# EAGLE schematic ignition_board_sch (EAGLE 8.6.0)
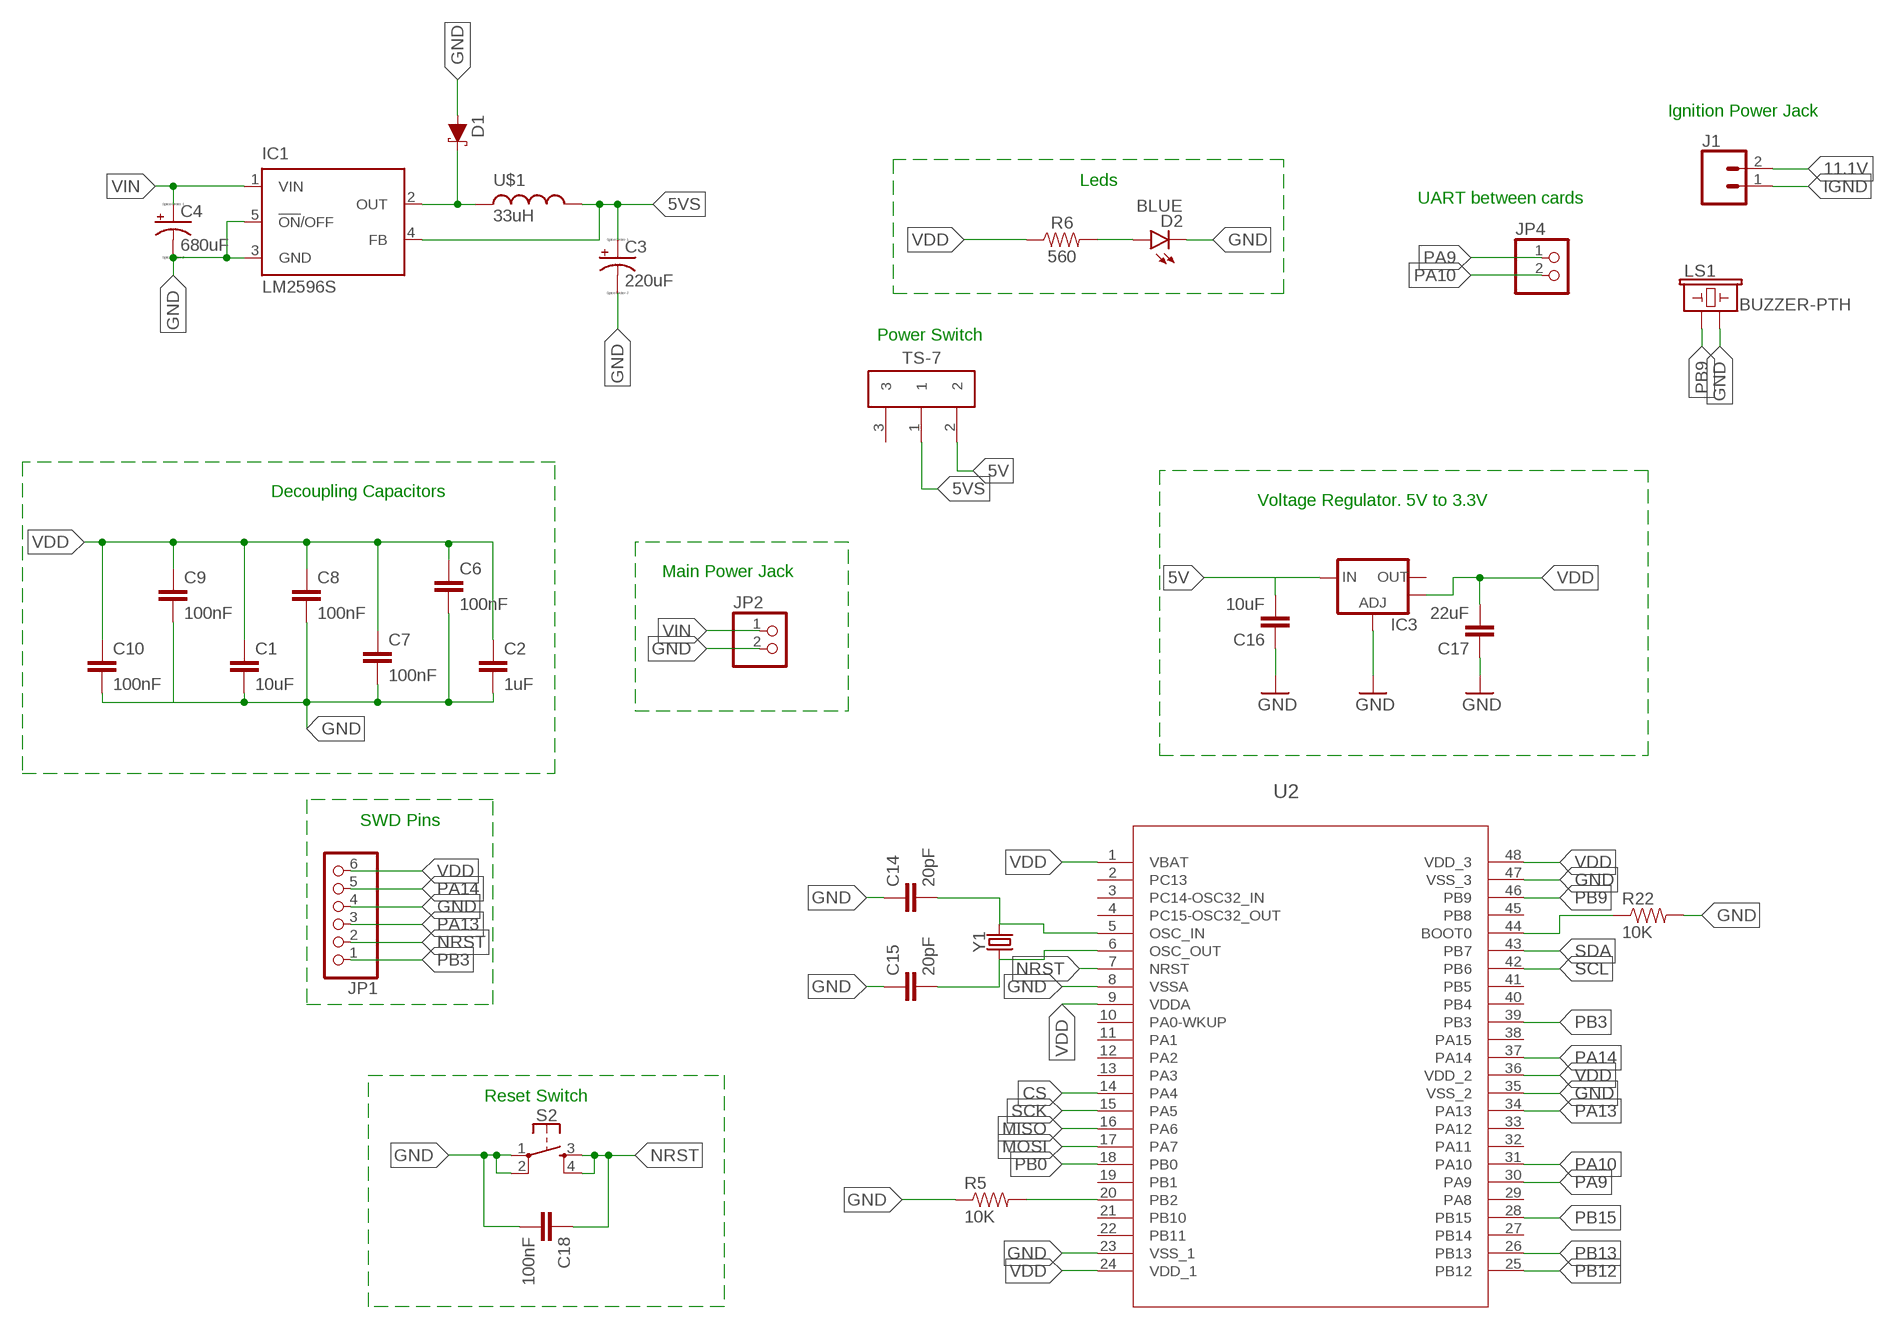
[diagram p0: schematic, sheet 1, part 1 of 2]
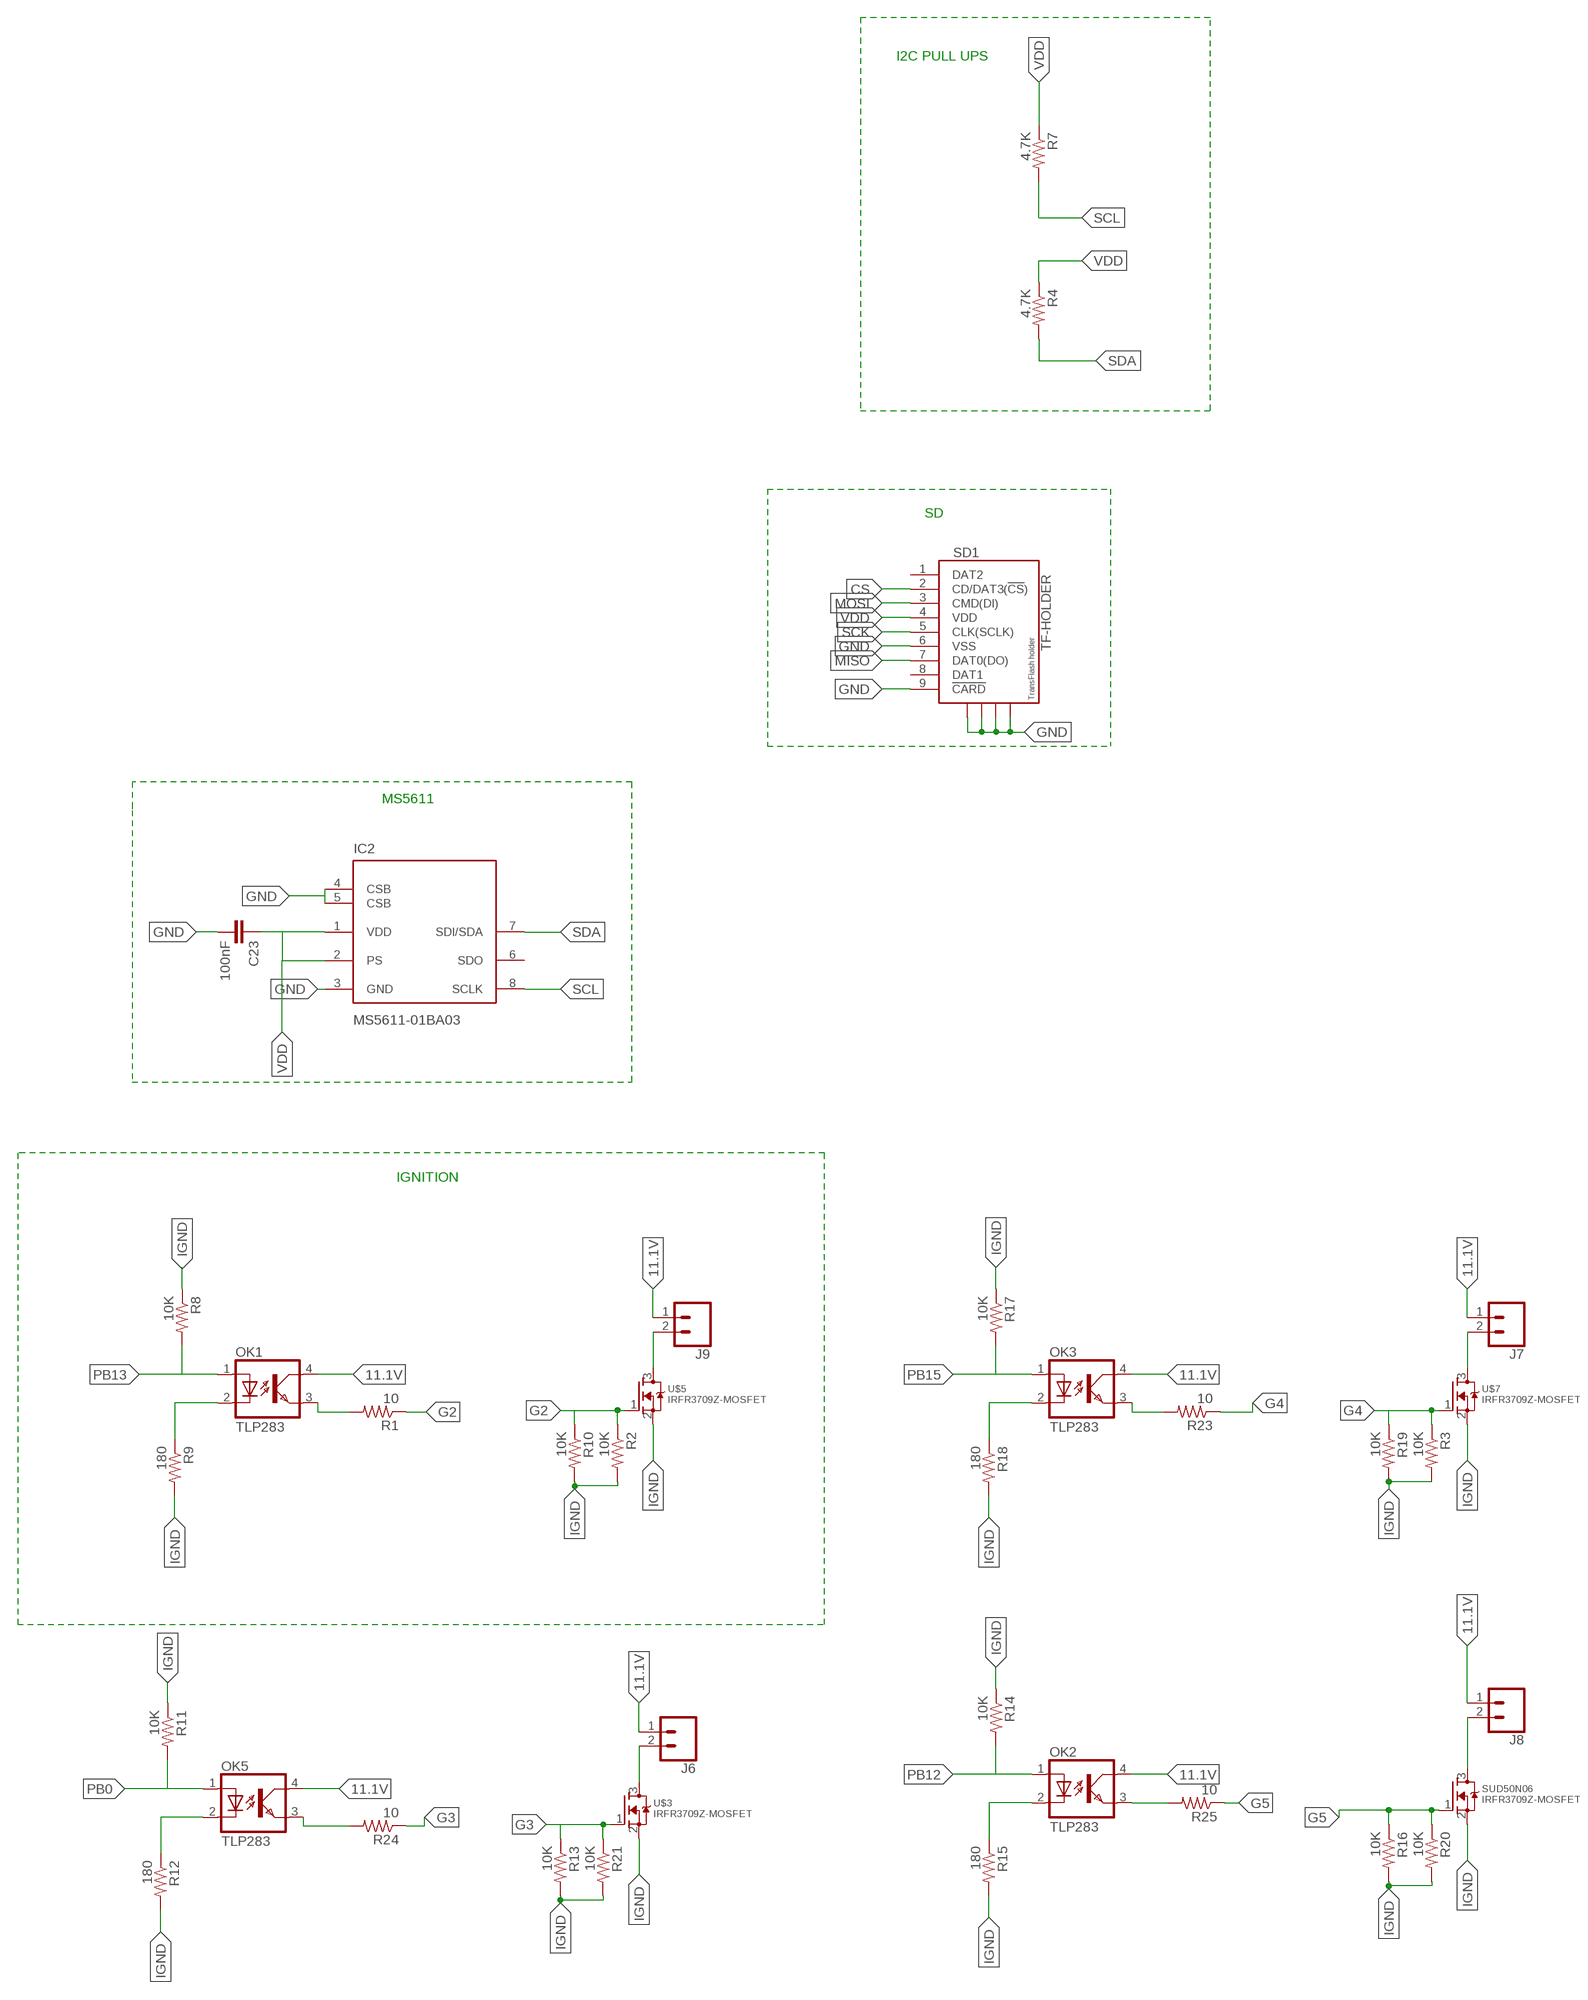
[diagram p1: schematic, sheet 1, part 2 of 2]

## Parts
C1  10uF  10UF-0805-10V-10%  [0805]
C2  1uF  10UF-0805-10V-10%  [0805]
C3  220uF  CPOL-USTT5D7  [TT5D7]
C4  680uF  CPOL-USTT5D7  [TT5D7]
C6  100nF  10UF-0805-10V-10%  [0805]
C7  100nF  10UF-0805-10V-10%  [0805]
C8  100nF  10UF-0805-10V-10%  [0805]
C9  100nF  10UF-0805-10V-10%  [0805]
C10  100nF  10UF-0805-10V-10%  [0805]
C14  20pF  10UF-0805-10V-10%  [0805]
C15  20pF  10UF-0805-10V-10%  [0805]
C16  10uF  CAP0805  [0805@2]
C17  22uF  CAP0805  [0805@2]
C18  100nF  10UF-0805-10V-10%  [0805]
C23  100nF  CAP0805  [0805@2]
D1  3A/40V/500mV  DIODE-SCHOTTKY-B340A  [SMA-DIODE]
D2  BLUE  LED-BLUE1206  [LED-1206]
IC1  LM2596S  [TO263-5]
IC2  MS5611-01BA03  [SON125P300X500X100-8N]
IC3  V_REG_LM1117SOT223  [SOT223]
J1  CONN_025MM  [SCREWTERMINAL-5MM-2]
J6  CONN_025MM  [SCREWTERMINAL-5MM-2]
J7  CONN_025MM  [SCREWTERMINAL-5MM-2]
J8  CONN_025MM  [SCREWTERMINAL-5MM-2]
J9  CONN_025MM  [SCREWTERMINAL-5MM-2]
JP1  PINHD-1X6  [1X06]
JP2  PINHD-1X2  [1X02]
JP4  PINHD-1X2/90  [1X02/90]
LS1  BUZZER-PTH  [BUZZER-12MM]
OK1  TLP283  [MINI-FLAT-4]
OK2  TLP283  [MINI-FLAT-4]
OK3  TLP283  [MINI-FLAT-4]
OK5  TLP283  [MINI-FLAT-4]
R1  10  RESISTOR0805-RES  [0805]
R2  10K  RESISTOR0805-RES  [0805]
R3  10K  RESISTOR0805-RES  [0805]
R4  4.7K  RESISTOR0805-RES  [0805]
R5  10K  RESISTOR0805-RES  [0805]
R6  560  0.3OHM-0805-1/8W-1%  [0805@1]
R7  4.7K  RESISTOR0805-RES  [0805]
R8  10K  RESISTOR0805-RES  [0805]
R9  180  RESISTOR0805-RES  [0805]
R10  10K  RESISTOR0805-RES  [0805]
R11  10K  RESISTOR0805-RES  [0805]
R12  180  RESISTOR0805-RES  [0805]
R13  10K  RESISTOR0805-RES  [0805]
R14  10K  RESISTOR0805-RES  [0805]
R15  180  RESISTOR0805-RES  [0805]
R16  10K  RESISTOR0805-RES  [0805]
R17  10K  RESISTOR0805-RES  [0805]
R18  180  RESISTOR0805-RES  [0805]
R19  10K  RESISTOR0805-RES  [0805]
R20  10K  RESISTOR0805-RES  [0805]
R21  10K  RESISTOR0805-RES  [0805]
R22  10K  RESISTOR0805-RES  [0805]
R23  10  RESISTOR0805-RES  [0805]
R24  10  RESISTOR0805-RES  [0805]
R25  10  RESISTOR0805-RES  [0805]
S2  MOMENTARY-SWITCH-SPST-2-SMD-5.2MM  [TACTILE_SWITCH_SMD_5.2MM]
SD1  TF-HOLDER  [TF-PULL]
SUD50N06  IRFR3709Z-MOSFET  [TO252]
TS-7  TS-7  [TS7]
U2  STM32F103CXT2  [LQFP48-7X7MM]
U$1  33uH  MSS1260  [MSS1260]
U$3  IRFR3709Z-MOSFET  [TO252]
U$5  IRFR3709Z-MOSFET  [TO252]
U$7  IRFR3709Z-MOSFET  [TO252]
Y1  CRYSTALPTH-HC49US  [HC49US]

## Nets
5V: C16.2 IC3.3(IN) TS-7.2
5VS: C3.+ IC1.4(FB) TS-7.1 U$1.P$1
11.1V: J1.2 J6.1 J7.1 J8.1 J9.1 OK1.4(COL) OK2.4(COL) OK3.4(COL) OK5.4(COL)
CS: SD1.2(CD/DAT3(!CS!)) U2.14(PA4)
G2: R1.1 R2.1 R10.1 U$5.1(G)
G3: R13.1 R21.1 R24.1 U$3.1(G)
G4: R3.1 R19.1 R23.1 U$7.1(G)
G5: R16.1 R20.1 R25.1 SUD50N06.1(G)
GND: C1.2 C2.2 C3.- C4.- C6.2 C7.2 C8.2 C9.2 C10.2 C14.1 C15.1 C16.1 C17.1 C18.2 C23.2 D1.A D2.C IC1.3(GND) IC1.5(!ON!/OFF) IC2.3(GND) IC2.4(CSB) IC2.5(CSB) IC3.1(ADJ) JP1.4 JP2.2 LS1.- R5.1 R22.2 S2.1 S2.2 SD1.6(VSS) SD1.9(!CARD) SD1.S1 SD1.S2 SD1.S3 SD1.S4 U2.8(VSSA) U2.23(VSS_1) U2.35(VSS_2) U2.47(VSS_3)
IGND: J1.1 R2.2 R3.2 R8.1 R9.2 R10.2 R11.1 R12.2 R13.2 R14.1 R15.2 R16.2 R17.1 R18.2 R19.2 R20.2 R21.2 SUD50N06.2(S) U$3.2(S) U$5.2(S) U$7.2(S)
MISO: SD1.7(DAT0(DO)) U2.16(PA6)
MOSI: SD1.3(CMD(DI)) U2.17(PA7)
N$2: C15.2 U2.6(OSC_OUT) Y1.1
N$3: C14.2 U2.5(OSC_IN) Y1.2
N$8: R22.1 U2.44(BOOT0)
N$11: D1.C IC1.2(OUT) U$1.P$2
N$12: OK1.3(EMIT) R1.2
N$13: R5.2 U2.20(PB2)
N$14: D2.A R6.2
N$15: OK2.3(EMIT) R25.2
N$17: J7.2 U$7.3(D)
N$18: J9.2 U$5.3(D)
N$19: J6.2 U$3.3(D)
N$21: OK3.3(EMIT) R23.2
N$22: OK5.2(C) R12.1
N$23: OK5.3(EMIT) R24.2
N$24: J8.2 SUD50N06.3(D)
N$25: OK2.2(C) R15.1
N$27: OK1.2(C) R9.1
N$31: OK3.2(C) R18.1
NRST: C18.1 JP1.2 S2.3 S2.4 U2.7(NRST)
PA9: JP4.1 U2.30(PA9)
PA10: JP4.2 U2.31(PA10)
PA13: JP1.3 U2.34(PA13)
PA14: JP1.5 U2.37(PA14)
PB0: OK5.1(A) R11.2 U2.18(PB0)
PB3: JP1.1 U2.39(PB3)
PB9: LS1.+ U2.46(PB9)
PB12: OK2.1(A) R14.2 U2.25(PB12)
PB13: OK1.1(A) R8.2 U2.26(PB13)
PB15: OK3.1(A) R17.2 U2.28(PB15)
SCK: SD1.5(CLK(SCLK)) U2.15(PA5)
SCL: IC2.8(SCLK) R7.2 U2.42(PB6)
SDA: IC2.7(SDI/SDA) R4.2 U2.43(PB7)
VDD: C1.1 C2.1 C6.1 C7.1 C8.1 C9.1 C10.1 C17.2 C23.1 IC2.1(VDD) IC2.2(PS) IC3.4(OUT) JP1.6 R4.1 R6.1 R7.1 SD1.4(VDD) U2.1(VBAT) U2.9(VDDA) U2.24(VDD_1) U2.36(VDD_2) U2.48(VDD_3)
VIN: C4.+ IC1.1(VIN) JP2.1
Unconnected: IC2.6(SDO) IC3.2(OUT) SD1.1(DAT2) SD1.8(DAT1) TS-7.3 U2.2(PC13) U2.3(PC14-OSC32_IN) U2.4(PC15-OSC32_OUT) U2.10(PA0-WKUP) U2.11(PA1) U2.12(PA2) U2.13(PA3) U2.19(PB1) U2.21(PB10) U2.22(PB11) U2.27(PB14) U2.29(PA8) U2.32(PA11) U2.33(PA12) U2.38(PA15) U2.40(PB4) U2.41(PB5) U2.45(PB8)

## Notes on the sheet
- I2C PULL UPS
- Ignition Power Jack
- Leds
- UART between cards
- Power Switch
- Decoupling Capacitors
- Voltage Regulator. 5V to 3.3V
- SD
- Main Power Jack
- SWD Pins
- MS5611
- Reset Switch
- IGNITION

## Library data of the parts
C1 = SparkFun-Capacitors:10UF: 10.0µF ceramic capacitors A capacitor is a passive two-terminal electrical component used to store electrical energy temporarily in an electric field.; PROD_ID: CAP-11330
C2 C6-C10 C14 C15 C18 = SparkFun-Capacitors:10UF: 10.0µF ceramic capacitors A capacitor is a passive two-terminal electrical component used to store electrical energy temporarily in an electric field.; PROD_ID: CAP-11330; VALUE: 10uF
C3 C4 = resistor:CPOL-US: POLARIZED CAPACITOR, American symbol
C16 C17 C23 = SparkFun-Capacitors:CAP: Capacitor Standard 0603 ceramic capacitor, and 0.1" leaded capacitor.
D1 = SparkFun-DiscreteSemi:DIODE-SCHOTTKY: Schottky diode A Schottky diode is a semiconductor diode which has a low forward voltage drop and a very fast switching action.; PROD_ID: DIO-09886
D2 = SparkFun-LED:LED-BLUE: Blue LEDs for production use Various blue LEDs stocked by SparkFun production 0603 - DIO-08575 Rebel - DIO-09553 1206 - DIO-09911; PROD_ID: DIO-09911
IC1 = national-semiconductor:LM2596: SIMPLE SWITCHER® Power Converter 150 kHz 3A Step-Down Voltage Regulator Source: http://www.national.com/ds/LM/LM2596.pdf; MF: NATIONAL SEMICONDUCTOR; MPN: LM2596S-ADJ/NOPB; OC_FARNELL: 9494367; OC_NEWARK: 41K3842
IC2 = Measurement-Specialties:MS5611-01BA03: Variometer Module, with stainless steel cap
IC3 = SparkFun:V_REG_LM1117: Voltage Regulator LM1117 Standard adjustable voltage regulator but in SMD form. Spark Fun Electronics SKU : COM-00595
J1 J6-J9 = SparkFun-Connectors:CONN_02: Multi connection point. Often used as Generic Header-pin footprint for 0.1 inch spaced/style header connections On any of the 0.1 inch spaced packages, you can populate with these: Break Away Headers - Straight <https://www.sparkfun.com/products/116> (PRT-00116) Break Away Male Headers - Right Angle <https://www.sparkfun.com/products/553> (PRT-00553) Female Headers <https://www.sparkfun.com/products/115> (PRT-00115) Break Away Headers - Machine Pin <https://www.sparkfun.com/products/117> (PRT-00117) Break Away Female Headers - Swiss Machine Pin <https://www.sparkfun.com/products/743> (PRT-00743) For SCREWTERMINALS and SPRING TERMINALS visit here: Screw Terimnals on SparkFun.com <https://www.sparkfun.com/search/results?term=Screw+Terminals> (5mm/3.5mm/2.54mm spacing) This device is also useful as a general connection point to wire up your design to another part of your project. Our various solder wires solder well into these plated through hole pads. Hook-Up Wire - Assortment (Stranded, 22 AWG) <https://www.sparkfun.com/products/11375> (PRT-11375) Hook-Up Wire - Assortment (Solid Core, 22 AWG) <https://www.sparkfun.com/products/11367> (PRT-11367) View the entire wire category on our website here <https://www.sparkfun.com/categories/141> Special notes: Molex polarized connector foot print use with: PRT-08233 with associated crimp pins and housings. 2.54_SCREWTERM for use with PRT-10571. 3.5mm Screw Terminal footprints for PRT-08084 5mm Screw Terminal footprints for use with PRT-08432; SF_SKU: PRT-08432
JP1 = pinhead:PINHD-1X6: PIN HEADER
JP2 JP4 = pinhead:PINHD-1X2: PIN HEADER
LS1 = SparkFun-Electromechanical:BUZZER: Buzzer Small round buzzers that operate around the audible 2kHz range. You can use these as speakers to create simple music or user interfaces. Variant Overview: PTH - Mini Speaker - PC Mount 12mm 2.048kHz <https://www.sparkfun.com/products/7950> PTH_KIT - Mini Speaker - PC Mount 12mm 2.048kHz <https://www.sparkfun.com/products/7950> KIT simplifies soldering by adding stop mask to one side of the pads. PTH_NO_SILK - Mini Speaker - PC Mount 12mm 2.048kHz <https://www.sparkfun.com/products/7950> No silkscreen indicator of buzzer outline. PTH_KIT_NO_SILK - Mini Speaker - PC Mount 12mm 2.048kHz <https://www.sparkfun.com/products/7950> KIT package w/o silkscreen SMD - Buzzer Audio Magnetic (CCV-084B16) SMD buzzer used on, e.g. the LilyPad Buzzer <https://www.sparkfun.com/products/8463> and RFID USB Reader <https://www.sparkfun.com/products/9963>. SMD_KIT - Buzzer Audio Magnetic (CCV-084B16) SMD Buzzer with elongated pins to make soldering easier. Used on the SparkFun Simon Says - Surface Mount Soldering Kit <https://www.sparkfun.com/products/10935>.; PROD_ID: COMP-08253; SF_SKU: COM-07950
OK1-OK3 OK5 = optocoupler:TLP283: TOSHIBA PHOTOCOUPLER GaAs IRED & PHOTO-TRANSISTOR Source: http://www.semicon.toshiba.co.jp/td/en/Opto/Photocoupler/en_20050928_TLP283_datasheet.pdf; OC_FARNELL: unknown; OC_NEWARK: unknown
R1-R5 R7-R25 = SparkFun-Resistors:RESISTOR: Resistor Basic schematic elements and footprints for 0603, 1206, and PTH resistors.
R6 = SparkFun-Resistors:0.3OHM: 0.3Ω resistor A resistor is a passive two-terminal electrical component that implements electrical resistance as a circuit element. Resistors act to reduce current flow, and, at the same time, act to lower voltage levels within circuits. - Wikipedia; PROD_ID: RES-11622; VALUE: 0.3
S2 = SparkFun-Switches:MOMENTARY-SWITCH-SPST-2: Momentary Switch (Pushbutton) - SPST - Two Circuits Normally-open (NO) SPST momentary switches (buttons, pushbuttons). Schematic symbol includes two switch circuits. Variants SMD-4.6MMX2.8MM - 4.60mm x 2.80mm Tactile Momentary Button Switch - Used on SparkFun SAMD21 Mini Breakout <https://www.sparkfun.com/products/13664> SMD-5.2MM - Mini Pushbutton Switch - SMD <https://www.sparkfun.com/products/8720> - Used on Arduino Pro Mini <https://www.sparkfun.com/products/11114>; PROD_ID: SWCH-08247; SF_SKU: COM-08720
SD1 = sd-mmc:TF-HOLDER: TF / Micro SD socket is PUSH-PUSH type, the card can be pushed into and auto locked and pushed out by simply press the card. Surface Mounting type.
SUD50N06 U$3 U$5 U$7 = Fuzzy:IRFR3709Z-MOSFET
TS-7 = ts-7-switch:TS-7
U2 = stm32f103cxt2:STM32F103CXT2; MANUFACTURER_PART_NUMBER: stm32f103cxt2; VENDOR: STMicroelectronics
U$1 = inductor-coilcraft:MSS1260: SMT Power Inductor
Y1 = SparkFun-Clocks:CRYSTAL: Crystals (Generic) These are passive quartz crystals, which can be used as a clock source for a microcontroller. Crystal's are two-terminal devices. They require external "load" capacitors to generate an oscillating signal.